# Altium project radFET-calibration_stand_card.PrjPcb
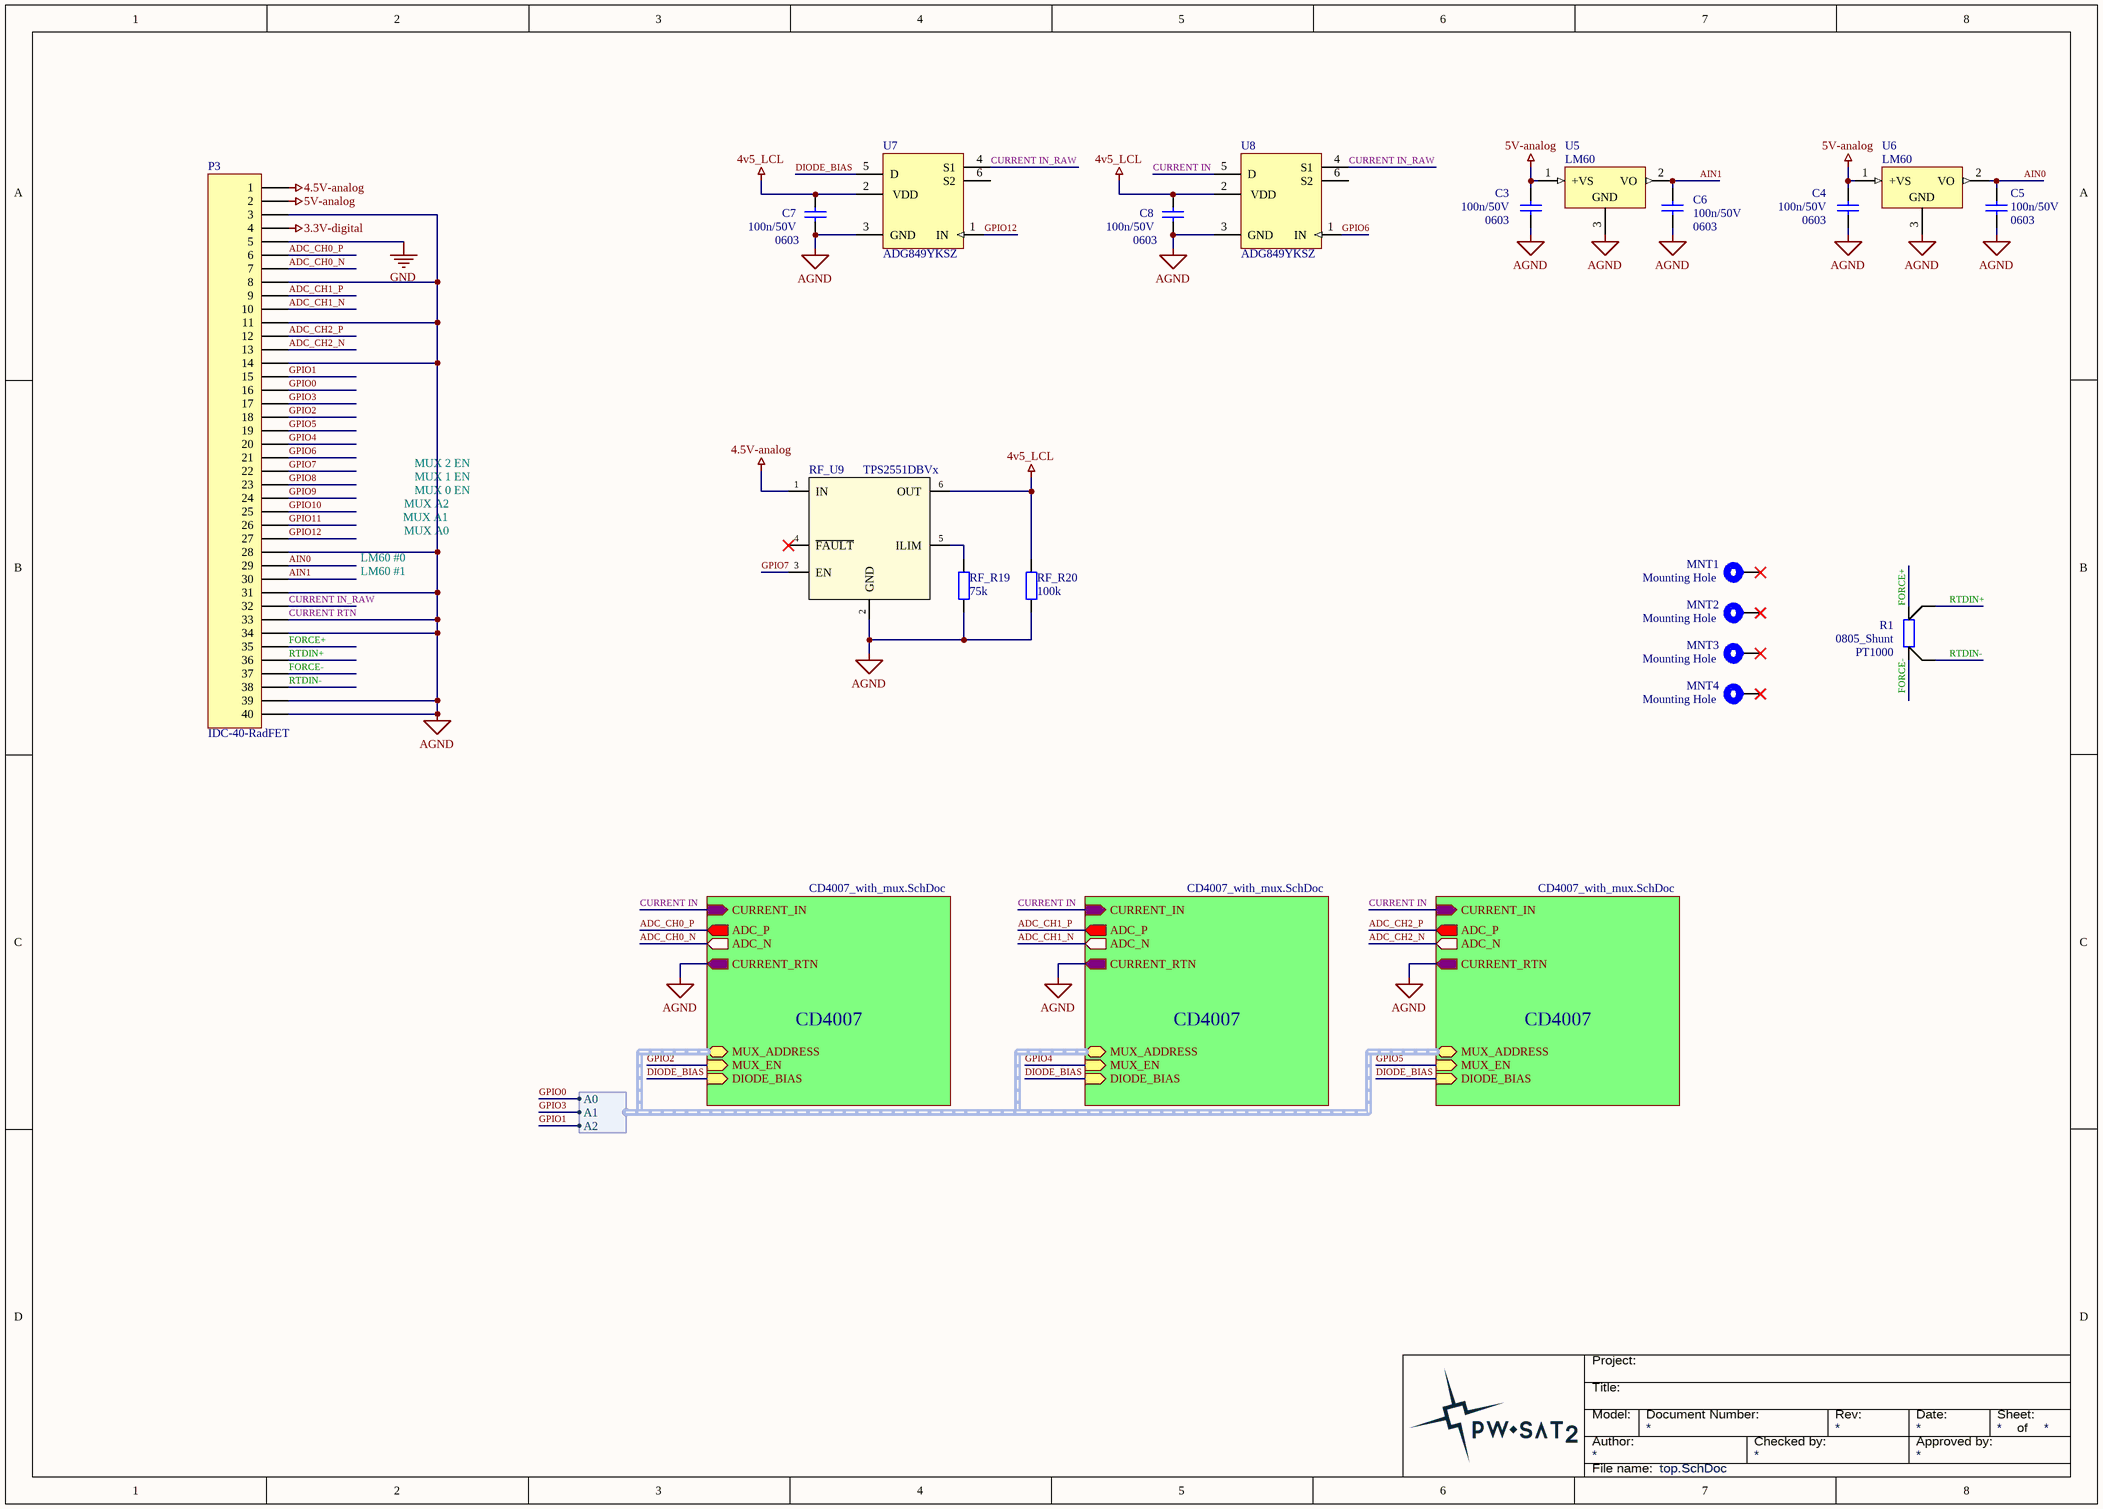
[diagram p0: top.SchDoc]
2 sheets, 73 parts. Net scope: hierarchical (ports join the sheet entries above them; power ports are global).
Board file: pcb.PcbDoc
Sheets:
  top.SchDoc
    CD4007 = CD4007_with_mux.SchDoc
    CD4007 = CD4007_with_mux.SchDoc
    CD4007 = CD4007_with_mux.SchDoc

## Sheet top.SchDoc: radFET Calibration Stand Card
size A3

### Parts
C3  Package: 0603  [SMD_Capacitor_0603]  (hidden comment: 100n/50V)
C4  Package: 0603  [SMD_Capacitor_0603]  (hidden comment: 100n/50V)
C5  Package: 0603  [SMD_Capacitor_0603]  (hidden comment: 100n/50V)
C6  Package: 0603  [SMD_Capacitor_0603]  (hidden comment: 100n/50V)
C7  Package: 0603  [SMD_Capacitor_0603]  (hidden comment: 100n/50V)
C8  Package: 0603  [SMD_Capacitor_0603]  (hidden comment: 100n/50V)
MNT1  Mounting Hole  [PC-104_PcbMntHole_M3]
MNT2  Mounting Hole  [PC-104_PcbMntHole_M3]
MNT3  Mounting Hole  [PC-104_PcbMntHole_M3]
MNT4  Mounting Hole  [PC-104_PcbMntHole_M3]
P3  IDC-40-RadFET  [IDC-40-Male-Socket-Angle]
R1  Package: 0805_Shunt  [SMD_Resistor-shunt_0805]  (hidden comment: PT1000)
RF_R19  75k  [SMD_Resistor_0603]
RF_R20  100k  [SMD_Resistor_0603]
RF_U9  TPS2551DBVx  [SOT23-6]
U5  LM60  [SOT23-3]
U6  LM60  [SOT23-3]
U7  ADG849YKSZ  [SC70-LT6_N]
U8  ADG849YKSZ  [SC70-LT6_N]

### Sub-sheets
CD4007 = CD4007_with_mux.SchDoc: CURRENT_IN (in), ADC_P (out), ADC_N (out), MUX_EN (in), MUX_ADDRESS (harness MUX_Address), CURRENT_RTN (out), DIODE_BIAS (in)
CD4007 = CD4007_with_mux.SchDoc: CURRENT_IN (in), ADC_P (out), ADC_N (out), MUX_EN (in), MUX_ADDRESS (harness MUX_Address), CURRENT_RTN (out), DIODE_BIAS (in)
CD4007 = CD4007_with_mux.SchDoc: CURRENT_IN (in), ADC_P (out), ADC_N (out), MUX_EN (in), MUX_ADDRESS (harness MUX_Address), CURRENT_RTN (out), DIODE_BIAS (in)

### Harnesses
MUX_Address: A0, A1, A2

### Nets
3.3V-digital: P3.4
4.5V-analog: P3.1 RF_U9.1(IN)
4v5_LCL: C7.1 C8.1 RF_R20.2 RF_U9.6(OUT) U7.2(VDD) U8.2(VDD)
5V-analog: C3.1 C4.1 P3.2 U5.1(+VS) U6.1(+VS)
CURRENT RTN: C3.2 C4.2 C5.2 C6.2 C7.2 C8.2 P3.3 P3.8 P3.11 P3.14 P3.28 P3.31 P3.33 P3.34 P3.39 P3.40 RF_R19.1 RF_R20.1 RF_U9.2(GND) U5.3(GND) U6.3(GND) U7.3(GND) U8.3(GND) ; sheet CD4007/CURRENT_RTN, sheet CD4007/CURRENT_RTN, sheet CD4007/CURRENT_RTN  [also labelled AGND]
GND: P3.5
ADC_CH0_N: P3.7 ; sheet CD4007/ADC_N
ADC_CH0_P: P3.6 P3.9 P3.12 U8.5(D) ; sheet CD4007/CURRENT_IN, sheet CD4007/ADC_P, sheet CD4007/CURRENT_IN, sheet CD4007/ADC_P, sheet CD4007/CURRENT_IN, sheet CD4007/ADC_P  [also labelled ADC_CH1_P, ADC_CH2_P, CURRENT IN]
ADC_CH1_N: P3.10 ; sheet CD4007/ADC_N
ADC_CH2_N: P3.13 ; sheet CD4007/ADC_N
AIN0: C5.1 P3.29 U6.2(VO)
AIN1: C6.1 P3.30 U5.2(VO)
CURRENT IN_RAW: P3.32 U7.4(S1) U8.4(S1)
DIODE_BIAS: U7.5(D) ; sheet CD4007/DIODE_BIAS, sheet CD4007/DIODE_BIAS, sheet CD4007/DIODE_BIAS
FORCE+: P3.35 R1.4
FORCE-: P3.37 R1.1
GPIO0: P3.16 ; sheet CD4007/MUX_ADDRESS.A0
GPIO1: P3.15 ; sheet CD4007/MUX_ADDRESS.A2
GPIO2: P3.18 ; sheet CD4007/MUX_EN
GPIO3: P3.17 ; sheet CD4007/MUX_ADDRESS.A1
GPIO4: P3.20 ; sheet CD4007/MUX_EN
GPIO5: P3.19 ; sheet CD4007/MUX_EN
GPIO6: P3.21 U8.1(IN)
GPIO7: P3.22 RF_U9.3(EN)
GPIO8: P3.23
GPIO9: P3.24
GPIO10: P3.25
GPIO11: P3.26
GPIO12: P3.27 U7.1(IN)
RTDIN+: P3.36 R1.3
RTDIN-: P3.38 R1.2
NetRF_R19_2: RF_R19.2 RF_U9.5(ILIM)

Not connected (* = marked no-connect by the designer): MNT1 1*; MNT2 1*; MNT3 1*; MNT4 1*; RF_U9 4(~{FAULT})*; U7 6(S2); U8 6(S2)

### Notes on the sheet
- MUX A2
- MUX 2 EN
- MUX 1 EN
- MUX 0 EN
- LM60 #0
- LM60 #1
- MUX A1
- MUX A0
- Title:
- Project:
- Author:
- Model:
- Document Number:
- Checked by:
- Rev:
- Date:
- Approved by:
- Sheet:
- of
- File name:

### Library data of the parts
C3-C8 = Cer_C0603T104K5RALTU: Ceramic Cap Kemet COTS 100n/50V X7R 0603; Manufacturer: Kemet; ManufacturerPartNumber: C0603T104K5RALTU; Value: 100n/50V
MNT1-MNT4 = MntHole: PCB Mounting Hole; Value: Mounting Hole
R1 = PT1000: Platinum Thin-Film Chip Sensor; Manufacturer: IST INNOVATIVE SENSOR TECHNOLOGY; ManufacturerPartNumber: P1K0.0805.2P.A; TCR: 3850ppm/K; Farnell: http://pl.farnell.com/ist-innovative-sensor-technology/p1k0-0805-2p-a/sensor-pt1000-smd0805-class-a/dp/1266951; Manufacturer's Datasheet: http://www.farnell.com/datasheets/57422.pdf; Value: PT1000
RF_R19 RF_R20 = Res: Package: 0603
  RF_R19: Value: 75k
  RF_R20: Value: 100k
RF_U9 = TPS2551DBVx: Adjustable Current-Limited Power-Distribution Switch.; Manufacturer: Texas Instruments; Value: TPS2551DBVx
U5 U6 = LM60: Analog temperature sensor
U7 U8 = ADG849YKSZ: CMOS Analog switch; Manufacturer: Analog Devices; ManufacturerPartNumber: ADG849YKSZ
P3 = IDC-40-RadFET: LatestRevisionDate: 17-Jul-2002; LatestRevisionNote: Re-released for DXP Platform.; Publisher: Altium Limited

## Sheet CD4007_with_mux.SchDoc: CD4007 with mux
size A3
Used 3 times, as channels CD4007, CD4007, CD4007. Parts and nets are listed once, with the designators drawn on the sheet.
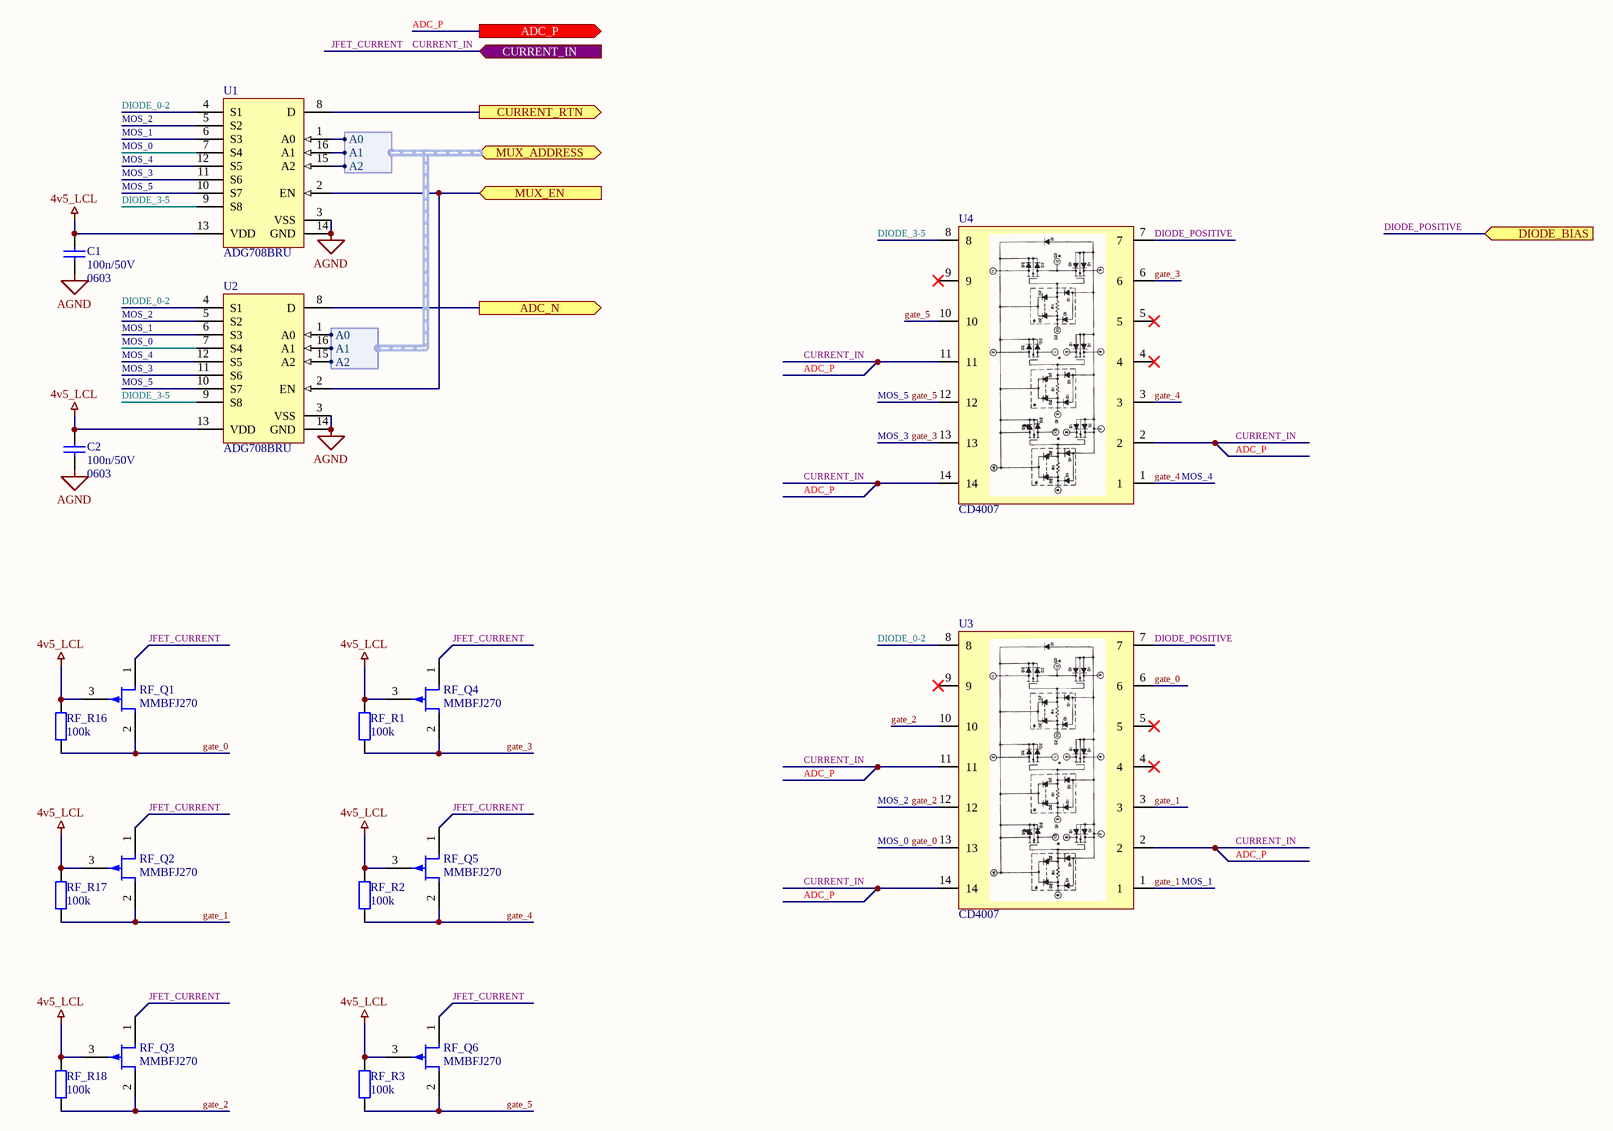
[diagram p1: CD4007_with_mux.SchDoc]

### Parts
C1  Package: 0603  [SMD_Capacitor_0603]  (hidden comment: 100n/50V)
C2  Package: 0603  [SMD_Capacitor_0603]  (hidden comment: 100n/50V)
RF_Q1  MMBFJ270  [SOT23-3]
RF_Q2  MMBFJ270  [SOT23-3]
RF_Q3  MMBFJ270  [SOT23-3]
RF_Q4  MMBFJ270  [SOT23-3]
RF_Q5  MMBFJ270  [SOT23-3]
RF_Q6  MMBFJ270  [SOT23-3]
RF_R1  100k  [SMD_Resistor_0603]
RF_R2  100k  [SMD_Resistor_0603]
RF_R3  100k  [SMD_Resistor_0603]
RF_R16  100k  [SMD_Resistor_0603]
RF_R17  100k  [SMD_Resistor_0603]
RF_R18  100k  [SMD_Resistor_0603]
U1  ADG708BRU  [ADI-RU-16_N]
U2  ADG708BRU  [ADI-RU-16_N]
U3  CD4007  [TSSOP14]
U4  CD4007  [TSSOP14]

### Ports
ADC_N (out), ADC_P (out), CURRENT_IN (in), CURRENT_RTN (out), DIODE_BIAS (in), MUX_ADDRESS (harness MUX_Address), MUX_EN (in)

### Harnesses
MUX_Address: A0, A1, A2

### Nets
4v5_LCL: C1.1 C2.1 RF_Q1.3(G) RF_Q2.3(G) RF_Q3.3(G) RF_Q4.3(G) RF_Q5.3(G) RF_Q6.3(G) RF_R1.2 RF_R2.2 RF_R3.2 RF_R16.2 RF_R17.2 RF_R18.2 U1.13(VDD) U2.13(VDD)
AGND: C1.2 C2.2 U1.3(VSS) U1.14(GND) U2.3(VSS) U2.14(GND)
ADC_N: U2.8(D) ; port ADC_N
ADC_P: RF_Q1.1(D) RF_Q2.1(D) RF_Q3.1(D) RF_Q4.1(D) RF_Q5.1(D) RF_Q6.1(D) U3.2 U3.11 U3.14 U4.2 U4.11 U4.14 ; port CURRENT_IN, port ADC_P  [also labelled CURRENT_IN, JFET_CURRENT]
CURRENT_RTN: U1.8(D) ; port CURRENT_RTN
DIODE_0-2: U1.4(S1) U2.4(S1) U3.8
DIODE_3-5: U1.9(S8) U2.9(S8) U4.8
DIODE_POSITIVE: U3.7 U4.7 ; port DIODE_BIAS
gate_0: RF_Q1.2(S) RF_R16.1 U1.7(S4) U2.7(S4) U3.6 U3.13  [also labelled MOS_0]
gate_1: RF_Q2.2(S) RF_R17.1 U1.6(S3) U2.6(S3) U3.1 U3.3  [also labelled MOS_1]
gate_2: RF_Q3.2(S) RF_R18.1 U1.5(S2) U2.5(S2) U3.10 U3.12  [also labelled MOS_2]
gate_3: RF_Q4.2(S) RF_R1.1 U1.11(S6) U2.11(S6) U4.6 U4.13  [also labelled MOS_3]
gate_4: RF_Q5.2(S) RF_R2.1 U1.12(S5) U2.12(S5) U4.1 U4.3  [also labelled MOS_4]
gate_5: RF_Q6.2(S) RF_R3.1 U1.10(S7) U2.10(S7) U4.10 U4.12  [also labelled MOS_5]
MUX_EN: U1.2(EN) U2.2(EN) ; port MUX_EN
NetU1_1: U1.1(A0) U2.1(A0) ; port MUX_ADDRESS.A0
NetU1_15: U1.15(A2) U2.15(A2) ; port MUX_ADDRESS.A2
NetU1_16: U1.16(A1) U2.16(A1) ; port MUX_ADDRESS.A1

Not connected (* = marked no-connect by the designer): U3 4* 5* 9*; U4 4* 5* 9*

### Channels
CD4007: designators end in _CD40073; ports ADC_N=ADC_CH0_N ADC_P=ADC_CH0_P CURRENT_IN=ADC_CH0_P CURRENT_RTN=CURRENT RTN DIODE_BIAS=DIODE_BIAS MUX_EN=GPIO2
CD4007: designators end in _CD40072; ports ADC_N=ADC_CH1_N ADC_P=ADC_CH0_P CURRENT_IN=ADC_CH0_P CURRENT_RTN=CURRENT RTN DIODE_BIAS=DIODE_BIAS MUX_EN=GPIO4
CD4007: designators end in _CD40071; ports ADC_N=ADC_CH2_N ADC_P=ADC_CH0_P CURRENT_IN=ADC_CH0_P CURRENT_RTN=CURRENT RTN DIODE_BIAS=DIODE_BIAS MUX_EN=GPIO5

### Notes on the sheet
- Title:
- Sheet:
- of
- Author:
- Model:
- Document Number:
- Checked by:
- Iss-Rev:
- Approved by:
- Date:
- File name:

### Library data of the parts
C1 C2 = Cer_C0603T104K5RALTU: Ceramic Cap Kemet COTS 100n/50V X7R 0603; Manufacturer: Kemet; ManufacturerPartNumber: C0603T104K5RALTU; Value: 100n/50V
RF_Q1-RF_Q6 = MMBFJ270: JFET, P-Channel, 3-Pin SOT-23, Pb-Free, Tape and Reel; Manufacturer: On Semiconductor; PackageDescription: 3-Pin Small Outline Transistor, Body 2.92 x 1.3 mm, Pitch 0.95 mm; RoHS: Pb-Free; Mounting Technology: Surface Mount; PartNumber: MMBFJ270; ComponentLink1Description: Manufacturer URL; ComponentLink1URL: http://www.onsemi.com/; ComponentLink2Description: Datasheet; ComponentLink2URL: http://www.onsemi.com/pub_link/Collateral/MMBFJ177LT1-D.PDF; ComponentLink3Description: Package Specification
RF_R1-RF_R3 RF_R16-RF_R18 = Res: Value: 100k; Package: 0603
U1 U2 = ADG708BRU: 1.8 to 5.5 V / +/-2.5 V, CMOS Low Voltage 3 Ohm, 8-Channel Multiplexer, -40 to 125 degC, 16-pin SOP (RU-16), Tube; Manufacturer: Analog Devices; Bandwidth (Hz): 55M; Max Analog Signal Range: Vss to Vdd; Ron (ohms): 3; Supply V Guar Performance: Dual_(+/-2.5V), Single_(+3V), Single_(+5V); t transition (s): 14n; DatasheetVersion: Rev. C; PackageVersion: Nov-02; PackageReference: RU-16; PackageDescription: 16-Pin Thin Shrink Small Outline Package, Body 5 x 4.4 mm, Pitch 0.65 mm; Supplier 1: Digi-Key; Supplier Part Number 1: ADG708BRU-ND; Supplier 2: Mouser; Supplier Part Number 2: 584-ADG708BRU; Packing: Tube; Mounting Technology: Surface Mount; Code_JEDEC: MO-153AB; PartNumber: ADG708BRU; ComponentLink1Description: Manufacturer URL; ComponentLink1URL: http://www.analog.com/en/index.html; ComponentLink2Description: Datasheet; ComponentLink2URL: http://www.analog.com/static/imported-files/data_sheets/ADG708_709.pdf; ComponentLink3Description: Package Specification; ComponentLink3URL: http:/www.analog.com/static/imported-files/packages/36244347913743854010197452789RU16.pdf
U3 U4 = CD4007: CMOS Dual Complementary Pair Plus Inverter; ComponentLink1URL: http://www.mouser.com/catalog/specsheets/AT45DB041D.pdf; ComponentLink1Description: Datasheet

## Nets that join several sheets
4v5_LCL: top (6 pins), CD4007 (16 pins), CD4007 (16 pins), CD4007 (16 pins)
CURRENT RTN: top (23 pins), CD4007 (7 pins), CD4007 (7 pins), CD4007 (7 pins)
ADC_CH0_N: top (P3.7), CD4007 (U2_CD40073.8)
ADC_CH0_P: top (P3.6 P3.9 P3.12 U8.5), CD4007 (12 pins), CD4007 (12 pins), CD4007 (12 pins)
ADC_CH1_N: top (P3.10), CD4007 (U2_CD40072.8)
ADC_CH2_N: top (P3.13), CD4007 (U2_CD40071.8)
DIODE_BIAS: top (U7.5), CD4007 (U3_CD40073.7 U4_CD40073.7), CD4007 (U3_CD40072.7 U4_CD40072.7), CD4007 (U3_CD40071.7 U4_CD40071.7)
GPIO0: top (P3.16), CD4007 (U1_CD40073.1 U2_CD40073.1), CD4007 (U1_CD40072.1 U2_CD40072.1), CD4007 (U1_CD40071.1 U2_CD40071.1)
GPIO1: top (P3.15), CD4007 (U1_CD40073.15 U2_CD40073.15), CD4007 (U1_CD40072.15 U2_CD40072.15), CD4007 (U1_CD40071.15 U2_CD40071.15)
GPIO2: top (P3.18), CD4007 (U1_CD40073.2 U2_CD40073.2)
GPIO3: top (P3.17), CD4007 (U1_CD40073.16 U2_CD40073.16), CD4007 (U1_CD40072.16 U2_CD40072.16), CD4007 (U1_CD40071.16 U2_CD40071.16)
GPIO4: top (P3.20), CD4007 (U1_CD40072.2 U2_CD40072.2)
GPIO5: top (P3.19), CD4007 (U1_CD40071.2 U2_CD40071.2)